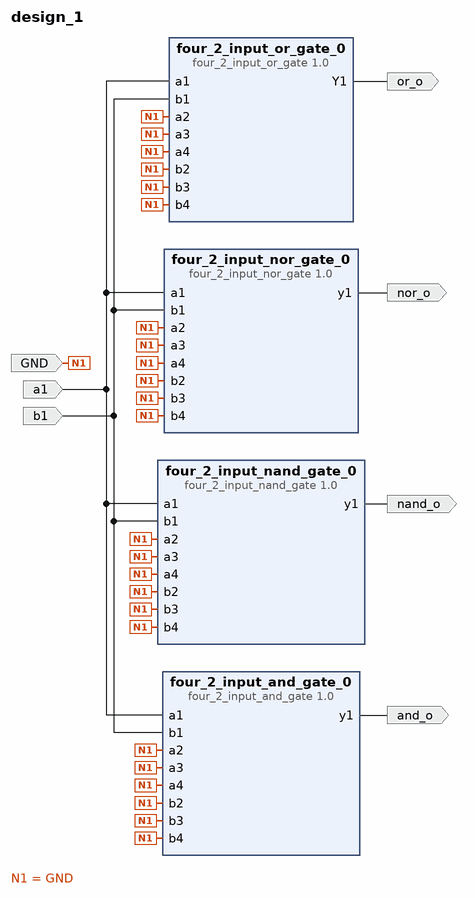
[diagram p0: block diagram of the top level]
# Vivado block design design_1, Vivado 2014.2
create_bd_design design_1

create_bd_port -dir I a1
create_bd_port -dir I b1
create_bd_port -dir I GND
create_bd_port -dir O nand_o
create_bd_port -dir O and_o
create_bd_port -dir O nor_o
create_bd_port -dir O or_o

create_bd_cell -type ip -vlnv xilinx.com:XUP:four_2_input_nand_gate:1.0 four_2_input_nand_gate_0
create_bd_cell -type ip -vlnv xilinx.com:XUP:four_2_input_nor_gate:1.0 four_2_input_nor_gate_0
create_bd_cell -type ip -vlnv xilinx.com:XUP:four_2_input_and_gate:1.0 four_2_input_and_gate_0
create_bd_cell -type ip -vlnv xilinx.com:XUP:four_2_input_or_gate:1.0 four_2_input_or_gate_0

# ---- connections ----

connect_bd_net -net a1_1 [get_bd_ports a1] \
  [get_bd_pins four_2_input_nand_gate_0/a1] [get_bd_pins four_2_input_nor_gate_0/a1] [get_bd_pins four_2_input_and_gate_0/a1] \
  [get_bd_pins four_2_input_or_gate_0/a1]
connect_bd_net -net b1_1 [get_bd_ports b1] \
  [get_bd_pins four_2_input_nand_gate_0/b1] [get_bd_pins four_2_input_and_gate_0/b1] [get_bd_pins four_2_input_nor_gate_0/b1] \
  [get_bd_pins four_2_input_or_gate_0/b1]
connect_bd_net [get_bd_ports GND] \
  [get_bd_pins four_2_input_nand_gate_0/a2] [get_bd_pins four_2_input_nand_gate_0/b2] \
  [get_bd_pins four_2_input_nand_gate_0/a3] [get_bd_pins four_2_input_nand_gate_0/b3] \
  [get_bd_pins four_2_input_nand_gate_0/a4] [get_bd_pins four_2_input_nand_gate_0/b4] \
  [get_bd_pins four_2_input_nor_gate_0/a2] [get_bd_pins four_2_input_nor_gate_0/b2] [get_bd_pins four_2_input_nor_gate_0/a3] \
  [get_bd_pins four_2_input_nor_gate_0/b3] [get_bd_pins four_2_input_nor_gate_0/a4] [get_bd_pins four_2_input_nor_gate_0/b4] \
  [get_bd_pins four_2_input_and_gate_0/a2] [get_bd_pins four_2_input_and_gate_0/b2] [get_bd_pins four_2_input_and_gate_0/a3] \
  [get_bd_pins four_2_input_and_gate_0/b3] [get_bd_pins four_2_input_and_gate_0/a4] [get_bd_pins four_2_input_and_gate_0/b4] \
  [get_bd_pins four_2_input_or_gate_0/a2] [get_bd_pins four_2_input_or_gate_0/b2] [get_bd_pins four_2_input_or_gate_0/a3] \
  [get_bd_pins four_2_input_or_gate_0/b3] [get_bd_pins four_2_input_or_gate_0/a4] [get_bd_pins four_2_input_or_gate_0/b4]
connect_bd_net [get_bd_pins four_2_input_nand_gate_0/y1] [get_bd_ports nand_o]
connect_bd_net [get_bd_pins four_2_input_and_gate_0/y1] [get_bd_ports and_o]
connect_bd_net [get_bd_pins four_2_input_nor_gate_0/y1] [get_bd_ports nor_o]
connect_bd_net [get_bd_pins four_2_input_or_gate_0/Y1] [get_bd_ports or_o]

validate_bd_design
save_bd_design
